# EAGLE design Tracking_V0.1 (EAGLE 7.2.0)
CNAME: EARS PocketQube HAB Tracking; CREVISION: 0.1; DESIGNER: M. Isbell
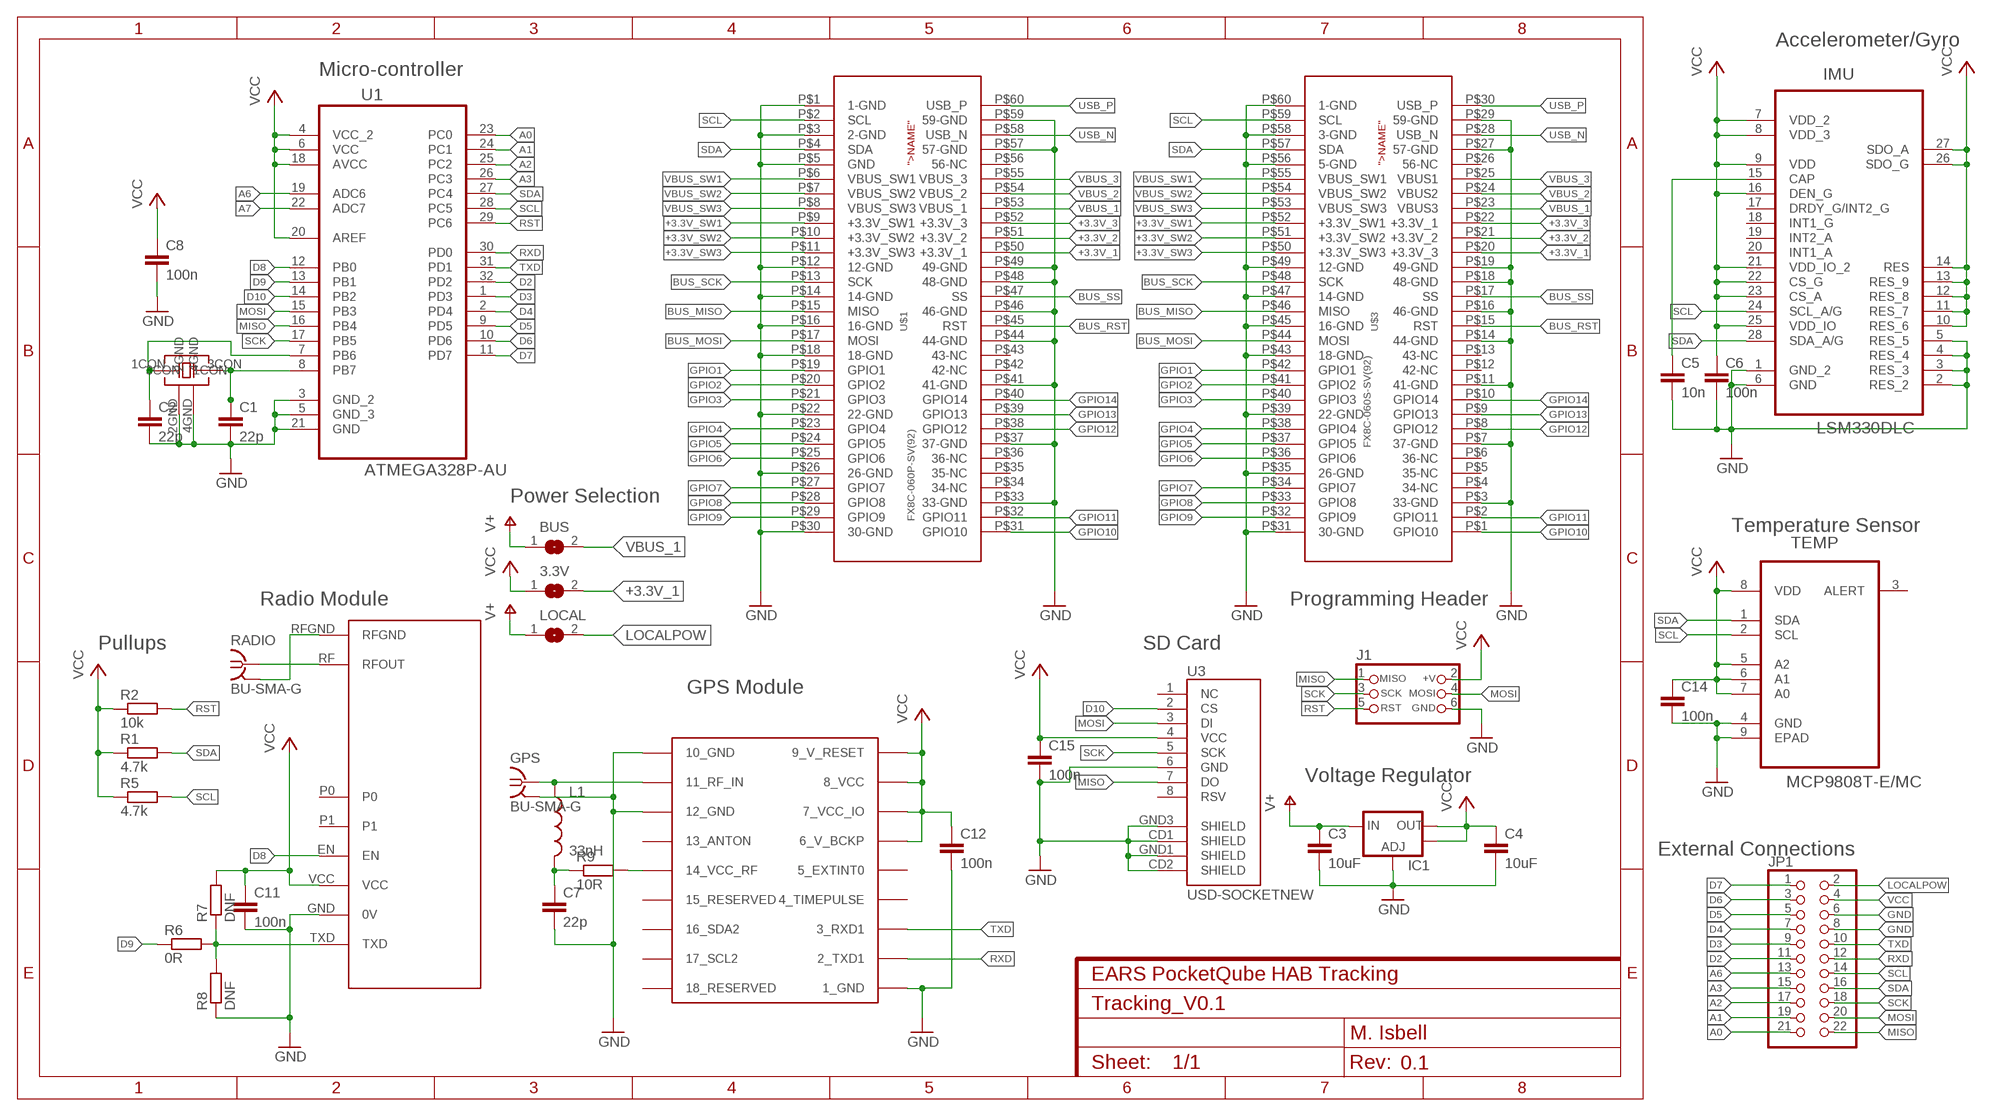
[diagram p0: schematic, sheet 1]

## Parts
3.3V  SJ  [SJ]
BUS  SJ  [SJ]
C1  22p  C-EUC0603  [C0603]
C2  22p  C-EUC0603  [C0603]
C3  10uF  C-EUC0603  [C0603]
C4  10uF  C-EUC0603  [C0603]
C5  10n  C-EUC0603  [C0603]
C6  100n  C-EUC0603  [C0603]
C7  22p  C-EUC0603  [C0603]
C8  100n  C-EUC0603  [C0603]
C11  100n  C-EUC0603  [C0603]
C12  100n  C-EUC0603  [C0603]
C14  100n  C-EUC0603  [C0603]
C15  100n  C-EUC0603  [C0603]
GPS  BU-SMA-G  [BU-SMA-G]
IC1  V_REG_LM1117SOT223  [SOT223]
IMU  LSM330DLC  [LGA28R50P6X8_400X500X110]
J1  CON_HEADER_PRG_AVR_ICSP-PTH  [HEADER_PRG_2X03]
JP1  PINHD-2X11  [2X11]
L1  33nH  INDUCTOR0603  [0603]
LOCAL  SJ  [SJ]
R1  4.7k  R-EU_R0603  [R0603]
R2  10k  R-EU_R0603  [R0603]
R5  4.7k  R-EU_R0603  [R0603]
R6  0R  R-EU_R0603  [R0603]
R7  DNF  R-EU_R0603  [R0603]
R8  DNF  R-EU_R0603  [R0603]
R9  10R  R-EU_R0603  [R0603]
RADIO  BU-SMA-G  [BU-SMA-G]
TEMP  MCP9808T-E/MC  [DFN300X200X100-9N]
U1  ATMEGA328P-AU  [QFP80P900X900X120-32N]
U3  USD-SOCKETNEW  [MICRO-SD-SOCKET-PP]
U$1  FX8C-060P-SV(92)  [FX8C-060P-SV(92)]
U$2  CRYSTAL  [CRYSTAL]
U$3  FX8C-060S-SV(92)  [FX8C-060S-SV(92)]
U$4  UBLOX_MAX  [UBLOX_MAX]
U$6  RADIOMETRIX-MTX2  [RADIOMETRIX-MTX2]

## Nets
+3.3V_1: 3.3V.2 U$1.P$50(+3.3V_1) U$3.P$20(+3.3V_3)
+3.3V_2: U$1.P$51(+3.3V_2) U$3.P$21(+3.3V_2)
+3.3V_3: U$1.P$52(+3.3V_3) U$3.P$22(+3.3V_1)
+3.3V_SW1: U$1.P$9(+3.3V_SW1) U$3.P$52(+3.3V_SW1)
+3.3V_SW2: U$1.P$10(+3.3V_SW2) U$3.P$51(+3.3V_SW2)
+3.3V_SW3: U$1.P$11(+3.3V_SW3) U$3.P$50(+3.3V_SW3)
A0: JP1.21 U1.23(PC0)
A1: JP1.19 U1.24(PC1)
A2: JP1.17 U1.25(PC2)
A3: JP1.15 U1.26(PC3)
A6: JP1.13 U1.19(ADC6)
A7: U1.22(ADC7)
BUS_MISO: U$1.P$15(MISO) U$3.P$46(MISO)
BUS_MOSI: U$1.P$17(MOSI) U$3.P$44(MOSI)
BUS_RST: U$1.P$45(RST) U$3.P$15(RST)
BUS_SCK: U$1.P$13(SCK) U$3.P$48(SCK)
BUS_SS: U$1.P$47(SS) U$3.P$17(SS)
D2: JP1.11 U1.32(PD2)
D3: JP1.9 U1.1(PD3)
D4: JP1.7 U1.2(PD4)
D5: JP1.5 U1.9(PD5)
D6: JP1.3 U1.10(PD6)
D7: JP1.1 U1.11(PD7)
D8: U1.12(PB0) U$6.EN
D9: R6.1 U1.13(PB1)
D10: U1.14(PB2) U3.2(CS)
GND: C1.2 C2.2 C3.2 C4.2 C5.2 C6.2 C7.2 C8.2 C11.2 C12.2 C14.2 C15.2 GPS.2 GPS.3 GPS.4 GPS.5 IC1.1(ADJ) IMU.1(GND_2) IMU.2(RES_2) IMU.3(RES_3) IMU.4(RES_4) IMU.5(RES_5) IMU.6(GND) J1.6(GND) JP1.6 JP1.8 R8.1 TEMP.4(GND) TEMP.9(EPAD) U1.3(GND_2) U1.5(GND_3) U1.21(GND) U3.6(GND) U3.CD1(SHIELD) U3.CD2(SHIELD) U3.GND1(SHIELD) U3.GND3(SHIELD) U$1.P$1(1-GND) U$1.P$3(2-GND) U$1.P$5(GND) U$1.P$12(12-GND) U$1.P$14(14-GND) U$1.P$16(16-GND) U$1.P$18(18-GND) U$1.P$22(22-GND) U$1.P$26(26-GND) U$1.P$30(30-GND) U$1.P$33(33-GND) U$1.P$37(37-GND) U$1.P$41(41-GND) U$1.P$44(44-GND) U$1.P$46(46-GND) U$1.P$48(48-GND) U$1.P$49(49-GND) U$1.P$57(57-GND) U$1.P$59(59-GND) U$2.2GND U$2.4GND U$3.P$3(33-GND) U$3.P$7(37-GND) U$3.P$11(41-GND) U$3.P$14(44-GND) U$3.P$16(46-GND) U$3.P$18(48-GND) U$3.P$19(49-GND) U$3.P$27(57-GND) U$3.P$29(59-GND) U$3.P$31(30-GND) U$3.P$35(26-GND) U$3.P$39(22-GND) U$3.P$43(18-GND) U$3.P$45(16-GND) U$3.P$47(14-GND) U$3.P$49(12-GND) U$3.P$56(5-GND) U$3.P$58(3-GND) U$3.P$60(1-GND) U$4.1_GND U$4.10_GND U$4.12_GND U$6.GND(0V)
GPIO1: U$1.P$19(GPIO1) U$3.P$42(GPIO1)
GPIO2: U$1.P$20(GPIO2) U$3.P$41(GPIO2)
GPIO3: U$1.P$21(GPIO3) U$3.P$40(GPIO3)
GPIO4: U$1.P$23(GPIO4) U$3.P$38(GPIO4)
GPIO5: U$1.P$24(GPIO5) U$3.P$37(GPIO5)
GPIO6: U$1.P$25(GPIO6) U$3.P$36(GPIO6)
GPIO7: U$1.P$27(GPIO7) U$3.P$34(GPIO7)
GPIO8: U$1.P$28(GPIO8) U$3.P$33(GPIO8)
GPIO9: U$1.P$29(GPIO9) U$3.P$32(GPIO9)
GPIO10: U$1.P$31(GPIO10) U$3.P$1(GPIO10)
GPIO11: U$1.P$32(GPIO11) U$3.P$2(GPIO11)
GPIO12: U$1.P$38(GPIO12) U$3.P$8(GPIO12)
GPIO13: U$1.P$39(GPIO13) U$3.P$9(GPIO13)
GPIO14: U$1.P$40(GPIO14) U$3.P$10(GPIO14)
LOCALPOW: JP1.2 LOCAL.2
MISO: J1.1(MISO) JP1.22 U1.16(PB4) U3.7(DO)
MOSI: J1.4(MOSI) JP1.20 U1.15(PB3) U3.3(DI)
N$1: GPS.1 L1.1 U$4.11_RF_IN
N$2: C1.1 U1.8(PB7) U$2.3CON
N$3: R9.2 U$4.14_VCC_RF
N$4: C2.1 U1.7(PB6) U$2.1CON
N$6: RADIO.1 U$6.RF(RFOUT)
N$7: R6.2 R7.1 R8.2 U$6.TXD
N$8: C7.1 L1.2 R9.1
N$12: C5.1 IMU.15(CAP)
RFGND: RADIO.2 RADIO.3 RADIO.4 RADIO.5 U$6.RFGND
RST: J1.5(RST) R2.2 U1.29(PC6)
RXD: JP1.12 U1.30(PD0) U$4.2_TXD1
SCK: J1.3(SCK) JP1.18 U1.17(PB5) U3.5(SCK)
SCL: IMU.24(SCL_A/G) JP1.14 R5.2 TEMP.2(SCL) U1.28(PC5) U$1.P$2(SCL) U$3.P$59(SCL)
SDA: IMU.28(SDA_A/G) JP1.16 R1.2 TEMP.1(SDA) U1.27(PC4) U$1.P$4(SDA) U$3.P$57(SDA)
TXD: JP1.10 U1.31(PD1) U$4.3_RXD1
USB_N: U$1.P$58(USB_N) U$3.P$28(USB_N)
USB_P: U$1.P$60(USB_P) U$3.P$30(USB_P)
V+: BUS.1 C3.1 IC1.3(IN) LOCAL.1
VBUS_1: BUS.2 U$1.P$53(VBUS_1) U$3.P$23(VBUS3)
VBUS_2: U$1.P$54(VBUS_2) U$3.P$24(VBUS2)
VBUS_3: U$1.P$55(VBUS_3) U$3.P$25(VBUS1)
VBUS_SW1: U$1.P$6(VBUS_SW1) U$3.P$55(VBUS_SW1)
VBUS_SW2: U$1.P$7(VBUS_SW2) U$3.P$54(VBUS_SW2)
VBUS_SW3: U$1.P$8(VBUS_SW3) U$3.P$53(VBUS_SW3)
VCC: 3.3V.1 C4.1 C6.1 C8.1 C11.1 C12.1 C14.1 C15.1 IC1.2(OUT) IC1.4(OUT) IMU.7(VDD_2) IMU.8(VDD_3) IMU.9(VDD) IMU.10(RES_6) IMU.11(RES_7) IMU.12(RES_8) IMU.13(RES_9) IMU.14(RES) IMU.16(DEN_G) IMU.21(VDD_IO_2) IMU.22(CS_G) IMU.23(CS_A) IMU.25(VDD_IO) IMU.26(SDO_G) IMU.27(SDO_A) J1.2(+V) JP1.4 R1.1 R2.1 R5.1 R7.2 TEMP.5(A2) TEMP.6(A1) TEMP.7(A0) TEMP.8(VDD) U1.4(VCC_2) U1.6(VCC) U1.18(AVCC) U1.20(AREF) U3.4(VCC) U$4.6_V_BCKP U$4.7_VCC_IO U$4.8_VCC U$4.9_V_RESET U$6.VCC
Unconnected: IMU.17(DRDY_G/INT2_G) IMU.18(INT1_G) IMU.19(INT2_A) IMU.20(INT1_A) TEMP.3(ALERT) U3.1(NC) U3.8(RSV) U$1.P$34(34-NC) U$1.P$35(35-NC) U$1.P$36(36-NC) U$1.P$42(42-NC) U$1.P$43(43-NC) U$1.P$56(56-NC) U$3.P$4(34-NC) U$3.P$5(35-NC) U$3.P$6(36-NC) U$3.P$12(42-NC) U$3.P$13(43-NC) U$3.P$26(56-NC) U$4.4_TIMEPULSE U$4.5_EXTINT0 U$4.13_ANTON U$4.15_RESERVED U$4.16_SDA2 U$4.17_SCL2 U$4.18_RESERVED U$6.P0 U$6.P1

## Notes on the sheet
- Accelerometer/Gyro
- Micro-controller
- Power Selection
- Temperature Sensor
- Radio Module | Programming Header
- Pullups | SD Card
- GPS Module
- Voltage Regulator
- External Connections

## Library data of the parts
3.3V BUS LOCAL = jumper:SJ: SMD solder JUMPER
C1 C2 C7 = rcl:C-EU: CAPACITOR, European symbol; OC_FARNELL: 2309012
C3 C4 = rcl:C-EU: CAPACITOR, European symbol; OC_FARNELL: 2426958
C5 = rcl:C-EU: CAPACITOR, European symbol; OC_FARNELL: 2066471
C6 C8 C11 C12 C14 C15 = rcl:C-EU: CAPACITOR, European symbol; OC_FARNELL: 2429362
GPS RADIO = con-coax:BU-SMA-G: FEMALE SMA CONNECTOR Radiall distributor RS 193-9117; OC_FARNELL: unknown; OC_NEWARK: unknown
IC1 = SparkFun:V_REG_LM1117: Voltage Regulator LM1117 Standard adjustable voltage regulator but in SMD form. Spark Fun Electronics SKU : COM-00595; OC_FARNELL: 1651283
IMU = mattsLib:LSM330DLC: ACC/GYRO, 3D, 16G, 2000DPS, 28LGA; MPN: LSM330DLC; OC_FARNELL: 2295820; OC_NEWARK: 68W6732; PACKAGE: LGA-28L; SUPPLIER: STMicroelectronics
J1 = dp_devices:CON_HEADER_PRG_AVR_ICSP: 2x3 AVR ICSP programming header; OC_FARNELL: 2311147
JP1 = pinhead:PINHD-2X11: PIN HEADER
L1 = SparkFun:INDUCTOR: Inductors Basic Inductor/Choke - 0603 and 1206. Footprints are not proven and vary greatly between part numbers.; OC_FARNELL: 2285904
R1 R5 R7 R8 = rcl:R-EU_: RESISTOR, European symbol; OC_FARNELL: 1799457
R2 = rcl:R-EU_: RESISTOR, European symbol; OC_FARNELL: 1652827
R6 = rcl:R-EU_: RESISTOR, European symbol; OC_FARNELL: 2309106
R9 = rcl:R-EU_: RESISTOR, European symbol; OC_FARNELL: 2321756
TEMP = mattsLib:MCP9808T-E/MC: TEMP SENSOR, I2C, -20 TO 100 DEG, 8DFN; MPN: MCP9808T-E/MC; OC_FARNELL: 2080524; OC_NEWARK: 73T0714; PACKAGE: 8DFN; SUPPLIER: Microchip
U1 = Atmel_By_element14_Batch_1-00:ATMEGA328P-AU: 8-bit Microcontroller with In-System Programmable Flash; MPN: ATMEGA328P-AU; OC_FARNELL: 1715486; OC_NEWARK: 14R4631; PACKAGE: TQFP-32; SUPPLIER: Atmel
U3 = SparkFun:USD-SOCKET: microSD Socket Push-push type uSD socket. Schematic element and footprint production proven. Spark Fun Electronics SKU : PRT-00127. tDoc lines correctly indicate media card edge positions when inserting (unlocked, locked, depressed).; OC_FARNELL: 2443092
U$1 = PQ_components:FX8C-060P-SV(92): FX8C-060P-SV(92) Hirose plug, for use in the PocketQube Standard boards. Device model created 10/2/14 By Stuart McAndrew AKA OzQube-1 Twitter - @ssshocker
U$2 = mattsLib:CRYSTAL; OC_FARNELL: 1842060
U$3 = PQ_components:FX8C-060S-SV(92): This is the bottom connector for a standard PocketQube board. Created by Stuart McAndrew AKA OzQube-1 17/2/14
U$4 = Ava:UBLOX_MAX: UBLOX MAX
U$6 = Ava:RADIOMETRIX-MTX2

## Board
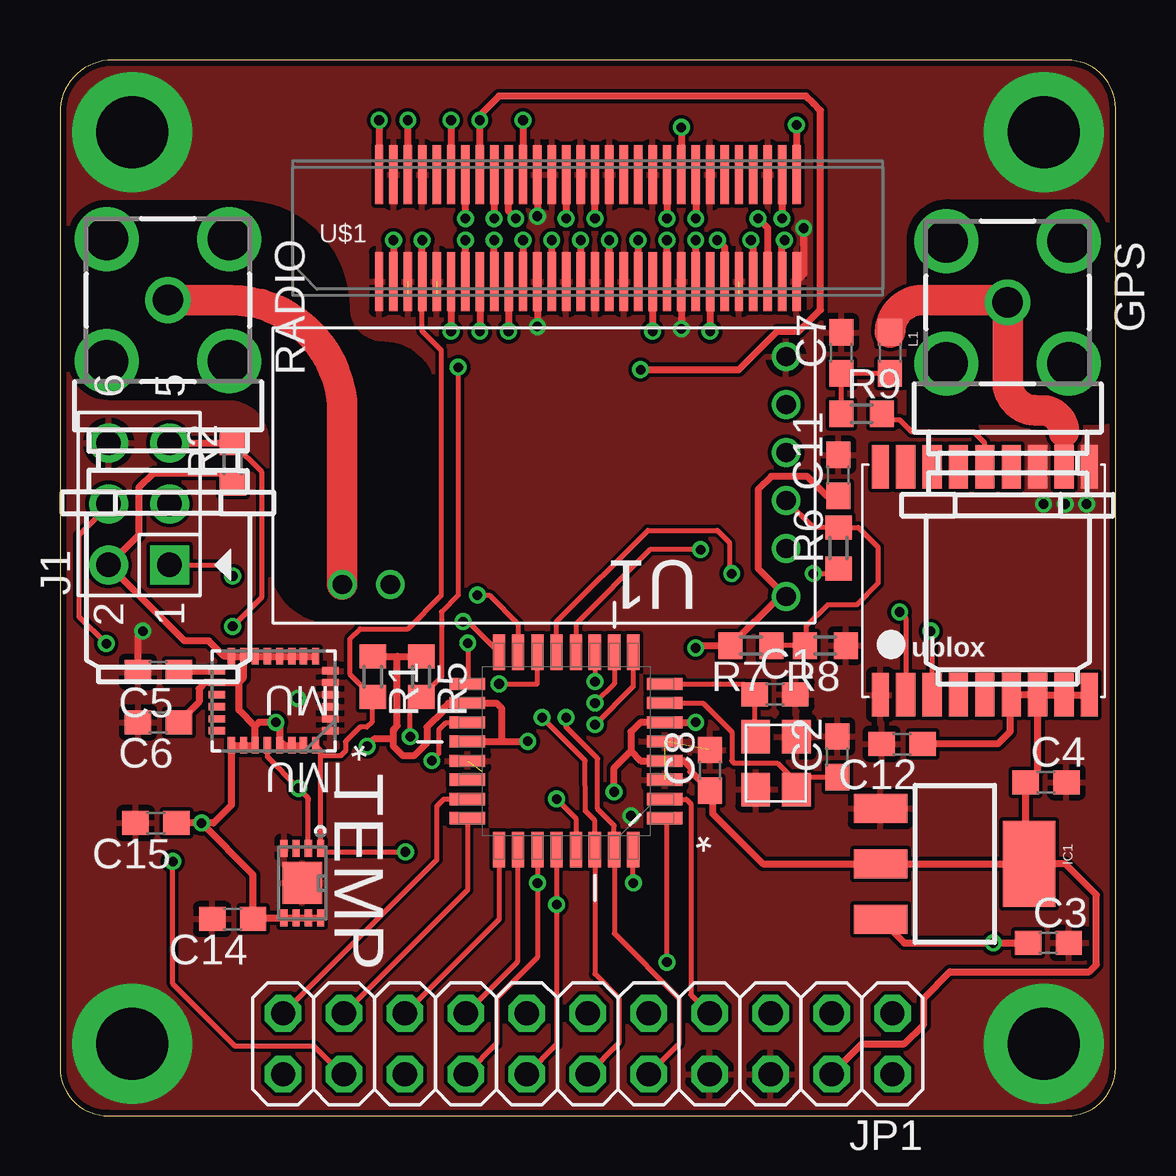
[diagram p1: board, top side]
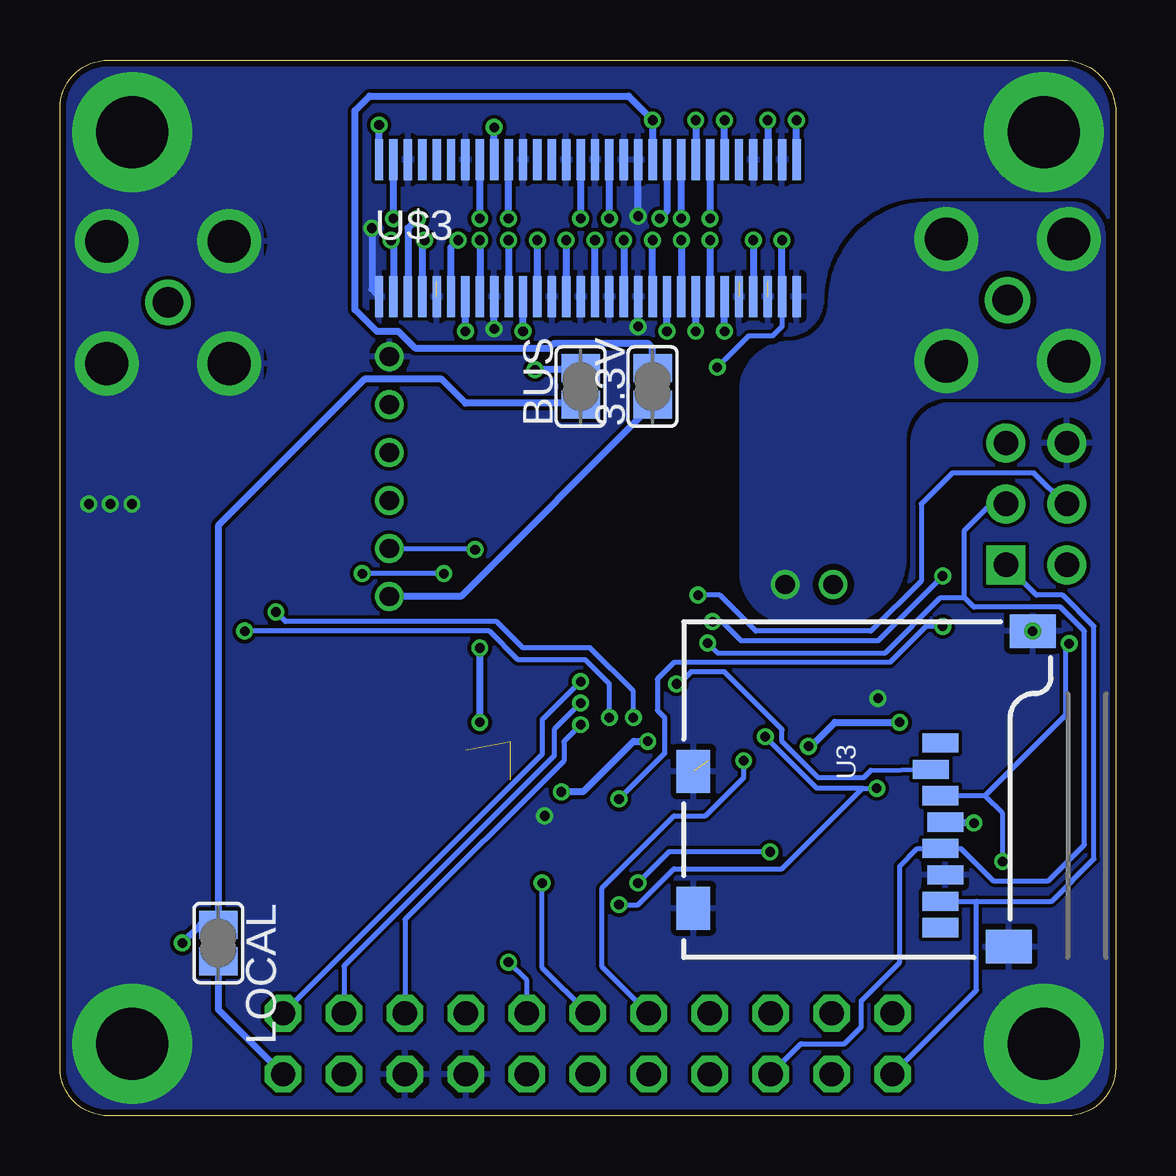
[diagram p2: board, bottom side, seen from below]

Size 44 x 44.01 mm. Coordinates in mm from the lower left corner, seen from the top.
Outline: 2,0 42,0 arc90 44,2 44,42 arc90 42,44 2.4,44 arc90 0,42 0,2 arc90 2,0
Copper layers (1*2*15*16): Top 0.035mm / dielectric 0.2mm / layer 2 0.0175mm / dielectric 1.1mm / layer 15 0.0175mm / dielectric 0.2mm / Bottom 0.035mm
Design rules "SeeedStudio_DRU_no_angle_20130527": minimum track width 6mil, minimum drill 12mil, track to track 6mil, track to pad 6mil, pad to pad 6mil, via to via 6mil, smd to smd 0mil, copper to edge 10mil, drill to drill 10mil, minimum pad ring 6mil, minimum via ring 6mil, stop-mask expansion 2mil, vias tented up to drill 25mil, thermal gap 10mil
tRestrict: area 35.5,29 to 43.5,38; 14 lines

### Footprints (pad centres in the part's own frame; a part is rotated, then mirrored left to right if it is on the bottom)
SJ = smd 1.168 x 1.6: 1 -0.762,0; 2 0.762,0
C0603 = smd 1.1 x 1: 1 -0.85,0; 2 0.85,0
BU-SMA-G = drill 1.27: 1 0,0 | drill 1.778: 2 -2.55,2.55; 3 2.55,2.55; 4 2.55,-2.55; 5 -2.55,-2.55
SOT223 = smd 1.219 x 2.235: 1 -2.311,-3.099; 2 0,-3.099; 3 2.311,-3.099 | smd 3.6 x 2.2: 4 0,3.099
LGA28R50P6X8_400X500X110 = smd 0.686 x 0.305: 1 -2.362,1.245; 2 -2.362,0.762; 3 -2.362,0.254; 4 -2.362,-0.254; 5 -2.362,-0.762; 6 -2.362,-1.245; 15 2.362,-1.245; 16 2.362,-0.762; 17 2.362,-0.254; 18 2.362,0.254; 19 2.362,0.762; 20 2.362,1.245 | smd 0.305 x 0.686: 7 -1.753,-1.854; 8 -1.245,-1.854; 9 -0.762,-1.854; 10 -0.254,-1.854; 11 0.254,-1.854; 12 0.762,-1.854; 13 1.245,-1.854; 14 1.753,-1.854; 21 1.753,1.854; 22 1.245,1.854; 23 0.762,1.854; 24 0.254,1.854; 25 -0.254,1.854; 26 -0.762,1.854; 27 -1.245,1.854; 28 -1.753,1.854
HEADER_PRG_2X03 = drill 1.02 pad 1.632 square: 1 -2.54,-1.27 | drill 1.02 pad 1.632: 2 -2.54,1.27; 3 0,-1.27; 4 0,1.27; 5 2.54,-1.27; 6 2.54,1.27
2X11 = drill 1.016 octagon: 1 -12.7,-1.27; 2 -12.7,1.27; 3 -10.16,-1.27; 4 -10.16,1.27; 5 -7.62,-1.27; 6 -7.62,1.27; 7 -5.08,-1.27; 8 -5.08,1.27; 9 -2.54,-1.27; 10 -2.54,1.27; 11 0,-1.27; 12 0,1.27; 13 2.54,-1.27; 14 2.54,1.27; 15 5.08,-1.27; 16 5.08,1.27; 17 7.62,-1.27; 18 7.62,1.27; 19 10.16,-1.27; 20 10.16,1.27; 21 12.7,-1.27; 22 12.7,1.27
0603 = smd 1.1 x 1: 1 -0.85,0; 2 0.85,0
R0603 = smd 1 x 1.1: 1 -0.85,0; 2 0.85,0
DFN300X200X100-9N = smd 0.711 x 0.305: 1 -1.448,0.762; 2 -1.448,0.254; 3 -1.448,-0.254; 4 -1.448,-0.762; 5 1.448,-0.762; 6 1.448,-0.254; 7 1.448,0.254; 8 1.448,0.762 | smd 1.753 x 1.651: 9 0,0
QFP80P900X900X120-32N = smd 1.473 x 0.508: 1 -4.115,2.794; 2 -4.115,2.007; 3 -4.115,1.194; 4 -4.115,0.406; 5 -4.115,-0.406; 6 -4.115,-1.194; 7 -4.115,-2.007; 8 -4.115,-2.794; 17 4.115,-2.794; 18 4.115,-2.007; 19 4.115,-1.194; 20 4.115,-0.406; 21 4.115,0.406; 22 4.115,1.194; 23 4.115,2.007; 24 4.115,2.794 | smd 0.508 x 1.473: 9 -2.794,-4.115; 10 -2.007,-4.115; 11 -1.194,-4.115; 12 -0.406,-4.115; 13 0.406,-4.115; 14 1.194,-4.115; 15 2.007,-4.115; 16 2.794,-4.115; 25 2.794,4.115; 26 2.007,4.115; 27 1.194,4.115; 28 0.406,4.115; 29 -0.406,4.115; 30 -1.194,4.115; 31 -2.007,4.115; 32 -2.794,4.115
MICRO-SD-SOCKET-PP = smd 0.8 x 1.5: 1 -8.94,10.7; 2 -7.84,10.3; 3 -6.74,10.7; 4 -5.64,10.9; 5 -4.54,10.7; 6 -3.44,10.9; 7 -2.34,10.7; 8 -1.24,10.7 | smd 1.8 x 1.4: CD1 -2.05,0.4; CD2 -7.75,0.4 | smd 1.4 x 1.9: GND1 -13.6,14.55; GND3 -0.45,13.55
FX8C-060P-SV(92) = smd 0.35 x 2.45: P$1 -8.7,-2.225; P$2 -8.1,-2.225; P$3 -7.5,-2.225; P$4 -6.9,-2.225; P$5 -6.3,-2.225; P$6 -5.7,-2.225; P$7 -5.1,-2.225; P$8 -4.5,-2.225; P$9 -3.9,-2.225; P$10 -3.3,-2.225; P$11 -2.7,-2.225; P$12 -2.1,-2.225; P$13 -1.5,-2.225; P$14 -0.9,-2.225; P$15 -0.3,-2.225; P$16 0.3,-2.225; P$17 0.9,-2.225; P$18 1.5,-2.225; P$19 2.1,-2.225; P$20 2.7,-2.225; P$21 3.3,-2.225; P$22 3.9,-2.225; P$23 4.5,-2.225; P$24 5.1,-2.225; P$25 5.7,-2.225; P$26 6.3,-2.225; P$27 6.9,-2.225; P$28 7.5,-2.225; P$29 8.1,-2.225; P$30 8.7,-2.225; P$31 8.7,2.225; P$32 8.1,2.225; P$33 7.5,2.225; P$34 6.9,2.225; P$35 6.3,2.225; P$36 5.7,2.225; P$37 5.1,2.225; P$38 4.5,2.225; P$39 3.9,2.225; P$40 3.3,2.225; P$41 2.7,2.225; P$42 2.1,2.225; P$43 1.5,2.225; P$44 0.9,2.225; P$45 0.3,2.225; P$46 -0.3,2.225; P$47 -0.9,2.225; P$48 -1.5,2.225; P$49 -2.1,2.225; P$50 -2.7,2.225; P$51 -3.3,2.225; P$52 -3.9,2.225; P$53 -4.5,2.225; P$54 -5.1,2.225; P$55 -5.7,2.225; P$56 -6.3,2.225; P$57 -6.9,2.225; P$58 -7.5,2.225; P$59 -8.1,2.225; P$60 -8.7,2.225
CRYSTAL = smd 1.4 x 1.2: 1CON 0.7,-2.3; 2GND 2.9,-2.3; 3CON 2.9,-0.6; 4GND 0.7,-0.6
FX8C-060S-SV(92) = smd 0.35 x 1.7: P$1 -8.7,2.85; P$2 -8.1,2.85; P$3 -7.5,2.85; P$4 -6.9,2.85; P$5 -6.3,2.85; P$6 -5.7,2.85; P$7 -5.1,2.85; P$8 -4.5,2.85; P$9 -3.9,2.85; P$10 -3.3,2.85; P$11 -2.7,2.85; P$12 -2.1,2.85; P$13 -1.5,2.85; P$14 -0.9,2.85; P$15 -0.3,2.85; P$16 0.3,2.85; P$17 0.9,2.85; P$18 1.5,2.85; P$19 2.1,2.85; P$20 2.7,2.85; P$21 3.3,2.85; P$22 3.9,2.85; P$23 4.5,2.85; P$24 5.1,2.85; P$25 5.7,2.85; P$26 6.3,2.85; P$27 6.9,2.85; P$28 7.5,2.85; P$29 8.1,2.85; P$30 8.7,2.85; P$31 -8.7,-2.85; P$32 -8.1,-2.85; P$33 -7.5,-2.85; P$34 -6.9,-2.85; P$35 -6.3,-2.85; P$36 -5.7,-2.85; P$37 -5.1,-2.85; P$38 -4.5,-2.85; P$39 -3.9,-2.85; P$40 -3.3,-2.85; P$41 -2.7,-2.85; P$42 -2.1,-2.85; P$43 -1.5,-2.85; P$44 -0.9,-2.85; P$45 -0.3,-2.85; P$46 0.3,-2.85; P$47 0.9,-2.85; P$48 1.5,-2.85; P$49 2.1,-2.85; P$50 2.7,-2.85; P$51 3.3,-2.85; P$52 3.9,-2.85; P$53 4.5,-2.85; P$54 5.1,-2.85; P$55 5.7,-2.85; P$56 6.3,-2.85; P$57 6.9,-2.85; P$58 7.5,-2.85; P$59 8.1,-2.85; P$60 8.7,-2.85
UBLOX_MAX = smd 1.8 x 0.7: 1_GND 4.95,-4.4; 9_V_RESET 4.95,4.3; 10_GND -4.55,4.3; 18_RESERVED -4.55,-4.4 | smd 1.8 x 0.8: 2_TXD1 4.95,-3.35; 3_RXD1 4.95,-2.25; 4_TIMEPULSE 4.95,-1.15; 5_EXTINT0 4.95,-0.05; 6_V_BCKP 4.95,1.05; 7_VCC_IO 4.95,2.15; 8_VCC 4.95,3.25; 11_RF_IN -4.55,3.25; 12_GND -4.55,2.15; 13_ANTON -4.55,1.05; 14_VCC_RF -4.55,-0.05; 15_RESERVED -4.55,-1.15; 16_SDA2 -4.55,-2.25; 17_SCL2 -4.55,-3.35
RADIOMETRIX-MTX2 = drill 0.8: EN 9.97,-3.25; GND 9.97,4.75; P0 9.97,2.75; P1 9.97,0.75; RF -8.53,-4.75; RFGND -6.53,-4.75; TXD 9.97,-1.25; VCC 9.97,-5.25

### Placement (x,y rotation side)
3.3V  19.3,30.4 90 bottom
BUS  22.3,30.4 90 bottom
C1  29.8,17.57 0 top
C2  32.4,14.96 90 top
C3  41.2,7.2 0 top
C4  41.1,13.9 0 top
C5  4.1,18.5 180 top
C6  4.1,16.4 180 top
C7  32.57,31.8 90 top
C8  27.1,14.4 90 top
C11  32.44,26.7 90 top
C12  35.1,15.5 180 top
C14  7.2,8.2 180 top
C15  4,12.2 180 top
GPS  39.5,33.9 270 top
IC1  37.3,10.5 270 top
IMU  8.9,17.3 180 top
J1  3.3,25.5 90 top
JP1  22,3 180 top
L1  34.6,31.8 270 top
LOCAL  37.4,7.2 270 bottom
R1  13.04,18.3 270 top
R2  7.2,27.2 90 top
R5  15.06,18.3 270 top
R6  32.45,23.67 90 top
R7  28.8,19.6 180 top
R8  31.9,19.6 180 top
R9  33.42,29.26 0 top
RADIO  4.5,34 270 top
TEMP  10.1,9.7 270 top
U1  21.1,15.2 180 top
U3  18,6.6 270 bottom
U$1  22,37 0 top
U$2  28.4,12.9 90 top
U$3  22,37 0 bottom
U$4  38.6,22.5 270 top
U$6  20.3,26.9 0 top

### Tracks (layer width: path | path; a pad name or v marks a point on that pad's centre or on a via)
+3.3V_1  (via drill 0.4)
  Top 0.3: v19.3,41.5 U$1.P$50
  Bottom 0.3: 3.3V.2 19.3,32 19.5,32.2 23.4,32.2 23.6,32 29.2,32 29.9,32.7 30.8,32.7 31.7,33.6 31.7,41.9 31.1,42.5 20.3,42.5 v19.3,41.5 U$3.P$20
+3.3V_2  (via drill 0.4)
  Top 0.3: v19,37.4 18.7,37.7 U$1.P$51
  Bottom 0.3: U$3.P$21 18.7,37.7 v19,37.4
+3.3V_3  (via drill 0.4)
  Top 0.3: U$1.P$52 v18.1,37.4
  Bottom 0.3: v18.1,37.4 U$3.P$22
+3.3V_SW1  (via drill 0.4)
  Top 0.3: U$1.P$9 v18.1,36.5
  Bottom 0.3: v18.1,36.5 U$3.P$52
+3.3V_SW2  (via drill 0.4)
  Top 0.3: U$1.P$10 v18.7,32.7
  Bottom 0.3: v18.7,32.7 U$3.P$51
+3.3V_SW3  (via drill 0.4)
  Top 0.3: v19.3,36.5 U$1.P$11
  Bottom 0.3: U$3.P$50 v19.3,36.5
A0
  Top 0.2: U1.23 15.99,13.19 15.7,12.9 15.7,10.67 JP1.21
A1
  Top 0.2: U1.24 16.98,9.41 JP1.19
A2
  Top 0.2: U1.25 18.31,8.2 JP1.17
A3
  Top 0.2: JP1.15 19.09,6.44 U1.26
A6  (via drill 0.4)
  Top 0.2: v15.5,14.8 15.8,15.1 15.8,16.1 16.09,16.39 U1.19
  Bottom 0.2: JP1.13 21.4,6.21 21.4,9.5 18.4,12.5 17.1,12.5 15.5,14.1 v15.5,14.8
BUS_MISO  (via drill 0.4)
  Top 0.3: v21.7,36.5 U$1.P$15
  Bottom 0.3: U$3.P$46 v21.7,36.5
BUS_MOSI  (via drill 0.4)
  Top 0.3: U$1.P$17 v22.9,36.5
  Bottom 0.3: v22.9,36.5 U$3.P$44
BUS_RST  (via drill 0.4)
  Top 0.3: v22.3,37.4 U$1.P$45
  Bottom 0.3: U$3.P$15 v22.3,37.4
BUS_SCK  (via drill 0.4)
  Top 0.3: U$1.P$13 v20.5,36.5
  Bottom 0.3: v20.5,36.5 U$3.P$48
BUS_SS  (via drill 0.4)
  Top 0.3: U$1.P$47 v21.1,37.4
  Bottom 0.3: v21.1,37.4 U$3.P$17
D2  (via drill 0.4)
  Top 0.2: v23.9,9.7 v23.89,9.71 U1.32
  Bottom 0.2: JP1.11 23.9,6.17 v23.9,9.7
D3  (via drill 0.4)
  Top 0.2: v25.3,6.4 25.3,12.32 U1.1
  Bottom 0.2: JP1.9 24.54,5.64 v25.3,6.4
D4
  Top 0.2: U1.2 26.11,13.19 26.3,13 26.3,5.05 JP1.7
D5  (via drill 0.4)
  Top 0.2: U1.9 23.89,17.89 v22.3,16.3
  Bottom 0.2: v22.3,16.3 23,15.6 23,14.8 29.62,8.18 JP1.5
D6  (via drill 0.4)
  Top 0.2: U1.10 23.11,18.01 v22.3,17.2
  Bottom 0.2: v22.3,17.2 23.4,16.1 23.4,15 32.16,6.24 JP1.3
D7  (via drill 0.4)
  Top 0.2: U1.11 v22.29,18.11 v22.3,18.1
  Bottom 0.2: v22.3,18.1 23.9,16.5 23.9,15.07 JP1.1
D8  (via drill 0.4)
  Top 0.2: v26.7,23.6 24.6,23.6 21.51,20.51 U1.12
  Bottom 0.2: U$6.EN 26.75,23.65 v26.7,23.6
D9  (via drill 0.4)
  Top 0.2: 32.33,22.7 R6.1 32.23,22.6 v31.4,22.6 | U1.13 20.69,20.59 24.5,24.4 27.4,24.4 27.9,23.9 27.9,22.7 v28,22.6
  Bottom 0.2: v28,22.6 v31.4,22.6
D10  (via drill 0.4)
  Top 0.2: v18.3,18 19.91,18.01 U1.14
  Bottom 0.2: v18.3,18 18.2,18 17.7,18.5 16.3,18.5 13.9,16.1 13.9,15.6 12.4,14.1 10.5,14.1 10.2,14.4 U3.2
GND  (via drill 0.4, 3 pad 5)  (6 unrouted)
  Top 0.3: U$1.P$49 v19.9,37.5 | U$1.P$22 v25.9,32.8 | U$1.P$30 31,35.08 v31,37 | U$1.P$12 v19.9,32.9 | C5.2 3.25,20 U3.GND1
  Bottom 0.3: v19.9,37.5 U$3.P$19 | v25.9,32.8 U$3.P$39 | v31,37 31,34.45 U$3.P$31 | v19.9,32.9 U$3.P$49 | U3.GND1 2.8,20.2
  other vias: 3,41 41,41 41,3 3,3 41,25.5 41.9,25.5 42.8,25.5 9.9,17.4 3.45,20.2 23.8,12.5
  pour Bottom (no thermals): 37,38 42.5,38 arc-90 43.9,36.6 43.9,25.9 arc-90 43,25 41,25 arc-90 40,26 40,26.5 arc90 38,28.5 arc-90 35.6,30.9 35.6,31.4 35.6,36.7 arc-90 36.9,38
  pour Top (no thermals): 39.9,26.7 39.9,26.2 arc90 41.1,25 43,25 arc90 44,26 44,28 arc90 43,29 40.9,29 arc90 40,28.1 40,26.8 arc-90
  pour Top (rank 2): 0,0 44,0 44,44 0,44
  pour Bottom (rank 2): 0,0 44,0 44,44 0,44
GPIO1  (via drill 0.4)
  Top 0.3: v24.1,36.5 U$1.P$19
  Bottom 0.3: U$3.P$42 v24.1,36.5
GPIO2  (via drill 0.4)
  Top 0.3: U$1.P$20 v24.7,32.7
  Bottom 0.3: v24.7,32.7 U$3.P$41
GPIO3  (via drill 0.4)
  Top 0.3: U$1.P$21 v25.3,36.5
  Bottom 0.3: v25.3,36.5 U$3.P$40
GPIO4  (via drill 0.4)
  Top 0.3: U$1.P$23 v26.5,36.5
  Bottom 0.3: v26.5,36.5 U$3.P$38
GPIO5  (via drill 0.4)
  Top 0.3: U$1.P$24 v27.1,32.7
  Bottom 0.3: v27.1,32.7 U$3.P$37
GPIO6  (via drill 0.4)
  Top 0.3: v27.4,36.5 27.7,36.2 U$1.P$25
  Bottom 0.3: U$3.P$36 27.7,36.2 v27.4,36.5
GPIO7  (via drill 0.4)
  Top 0.3: U$1.P$27 28.9,36.4 v28.8,36.5
  Bottom 0.3: v28.8,36.5 28.9,36.4 U$3.P$34
GPIO8  (via drill 0.4)
  Top 0.3: U$1.P$28 29.5,37 v29.1,37.4
  Bottom 0.3: v29.1,37.4 29.5,37 U$3.P$33
GPIO9  (via drill 0.4)
  Top 0.3: U$1.P$29 30.1,36.4 v30.2,36.5
  Bottom 0.3: v30.2,36.5 30.1,36.4 U$3.P$32
GPIO10  (via drill 0.4)
  Top 0.3: v30.7,41.3 U$1.P$31
  Bottom 0.3: U$3.P$1 v30.7,41.3
GPIO11  (via drill 0.4)
  Top 0.3: U$1.P$32 v30.1,37.4
  Bottom 0.3: v30.1,37.4 U$3.P$2
GPIO12  (via drill 0.4)
  Top 0.3: U$1.P$38 v26.5,37.4
  Bottom 0.3: v26.5,37.4 U$3.P$8
GPIO13  (via drill 0.4)
  Top 0.3: v25.9,41.2 U$1.P$39
  Bottom 0.3: U$3.P$9 v25.9,41.2
GPIO14  (via drill 0.4)
  Top 0.3: U$1.P$40 v25.3,37.4
  Bottom 0.3: v25.3,37.4 U$3.P$10
LOCALPOW
  Bottom 0.3: LOCAL.2 37.4,4.43 JP1.2
MISO  (via drill 0.4)
  Top 0.2: J1.1 6.74,22.96 v7.2,22.5 | v16.8,20.6 17.02,20.6 U1.16
  Bottom 0.2: JP1.22 5.8,5.23 5.8,8.94 | U3.7 5.8,8.94 | 5.8,8.94 2.66,8.94 0.9,10.7 0.9,20.4 2.2,21.7 3.3,21.7 J1.1 | v7.2,22.5 9.9,19.8 15.6,19.8 16.4,20.6 v16.8,20.6
MOSI  (via drill 0.4)
  Top 0.2: JP1.20 11.77,1.73 10.6,2.9 7.3,2.9 4.7,5.5 v4.7,10.6 | v1.93,19.68 0.8,20.8 0.8,24.2 2.03,25.43 J1.4 | v17.4,21.7 17.9,21.7 19.09,20.51 U1.15
  Bottom 0.2: v4.7,10.6 4.7,12.6 5.44,13.34 | 5.44,13.34 U3.3 | 5.44,13.34 2.1,16.68 2.1,19.51 v1.93,19.68 | v17.4,21.7 16.5,21.7 15,20.2 10.2,20.2 8.1,22.3 8.1,25.5 6.8,26.8 3.4,26.8 2.1,25.5 J1.4
N$1
  Top 0.8: 41.85,28.49 U$4.11_RF_IN
  Top 1.27: 41.85,28.49 arc90 40.94,29.4 40.7,29.4 arc-90 39.5,30.6 GPS.1 39.5,34 35.95,34 arc90 L1.1
N$2
  Top 0.2: U$2.3CON 28.95,15.85 C1.1 28.53,17.99 U1.8
N$3
  Top 0.2: U$4.14_VCC_RF 38.55,28.05 38.1,28.5 35.5,28.5 35,29 34.53,29 R9.2
N$4
  Top 0.2: C2.1 31.21,14.11 U$2.1CON 30.5,13.8 30.5,14.1 29.9,14.7 28.1,14.7 28,14.8 28,16 26.79,17.21 U1.7
N$6
  Top 1.27: U$6.RF 11.77,29.33 arc90 7.1,34 RADIO.1
N$7
  Top 0.2: R7.1 R8.2 31.1,19.65 31.1,20.4 32,21.3 33.2,21.3 34.1,22.2 34.1,23.7 33.28,24.52 R6.2 31.4,24.52 U$6.TXD
N$8
  Top 0.2: R9.1 C7.1 L1.2
N$12
  Top 0.3: C5.1 5.2,18.55 IMU.15
RFGND
  pour Bottom (isolate 0.254, no thermals): 1.9,38 7.8,38 arc-90 11.9,33.9 arc90 13.6,32.2 arc-90 15.6,30.2 15.6,22.7 arc-90 13.5,20.6 11.5,20.6 arc-90 8.8,23.3 8.8,27 8.8,28.2 arc90 7,30 2,30 arc-90 0.5,31.5 0.5,36.7 arc-90 1.8,38
RST  (via drill 0.4)
  Top 0.2: R2.2 8.4,26.85 8.4,21.6 v7.2,20.4 | v20.7,13.2 21.51,12.39 U1.29
  Top 0.3: J1.5 R2.2
  Bottom 0.2: v20.7,13.2 18.8,15.1 18.8,16.6 19.1,16.9 19.1,18.2 18.4,18.9 9.4,18.9 7.9,20.4 v7.2,20.4
RXD  (via drill 0.4)
  Top 0.2: JP1.12 23.3,3.03 23.3,4.9 22.29,5.91 U1.30 22.29,12.31 21.9,12.7 21.89,14.81 v20.1,16.6 | v35,21 35.25,20.75 U$4.2_TXD1
  Bottom 0.2: v20.1,16.6 20.1,17.7 21.9,19.5 24.7,19.5 25.8,20.6 34.6,20.6 v35,21
SCK  (via drill 0.4)
  Top 0.2: v17,19.7 17,18.01 U1.17
  Bottom 0.2: JP1.18 13.11,3 11.3,3 10.6,3.7 10.6,4.8 9,6.4 9,10.4 8.26,11.14 U3.5 6.44,11.14 5.1,9.8 2.8,9.8 1.3,11.3 1.3,20.2 2.3,21.2 5.9,21.2 6.3,21.6 | 6.3,21.6 6.3,24.4 5.2,25.5 J1.3 | v17,19.7 16.6,19.3 9.6,19.3 7.3,21.6 6.3,21.6
  Bottom 0.3: J1.3 4.7,25.5
SCL  (via drill 0.4)
  Top 0.2: U1.28 v20.7,8.8 20.7,2.97 JP1.14 | TEMP.2 10.35,13.15 10.35,13.24 v9.95,13.65 8.65,14.95 IMU.24 | v14.6,15.8 14.6,17.4 15.1,17.41 R5.2 15.9,18.29 15.9,21 16.6,21.7 v16.6,31.2
  Top 0.3: v13.9,36.5 U$1.P$2
  Bottom 0.2: v20.7,8.8 19.9,8.8 18.4,10.3 13.9,10.3 10.55,13.65 | 10.55,13.65 v9.95,13.65 | 10.55,13.65 12.45,13.65 v14.6,15.8 | U$3.P$59 13.9,32.9 14.3,32.5 15.3,32.5 v16.6,31.2
  Bottom 0.3: U$3.P$59 v13.9,36.5
SDA  (via drill 0.4)
  Top 0.2: U1.27 v19.91,9.7 19.91,6.61 18.2,4.9 18.2,3.01 JP1.16 | v14.4,11 11.01,11 TEMP.1 10.86,15 | 10.86,15 10.86,15.24 IMU.28 | 10.86,15 11.7,15 11.9,15.2 11.9,15.6 12.5,16.2 12.8,16.2 13,16.4 13,17.1 13.04,17.18 R1.2 12.1,18.39 12.1,19.9 12.5,20.3 14.5,20.3 15.9,21.7 15.9,31.9 15.1,32.7 U$1.P$4
  Top 0.3: U$1.P$4 v15.1,36.5
  Bottom 0.2: v14.4,11 18.61,11 v19.91,9.7
  Bottom 0.3: v15.1,36.5 U$3.P$57
TXD  (via drill 0.4)
  Top 0.2: JP1.10 25.8,2.99 25.8,4.9 23.11,7.59 U1.31 23.1,12.1 22.41,12.79 22.41,14.89 21.1,16.2 v21.1,16.6 | v36.3,20.2 36.35,20.15 U$4.3_RXD1
  Bottom 0.2: v21.1,16.6 21.1,18 22.1,19 24.9,19 26.1,20.2 v36.3,20.2
USB_N  (via drill 0.4)
  Top 0.3: U$1.P$58 v14.5,41.5
  Bottom 0.3: v14.5,41.5 U$3.P$28
USB_P  (via drill 0.4)
  Top 0.3: v13.3,41.5 U$1.P$60
  Bottom 0.3: U$3.P$30 v13.3,41.5
V+  (via drill 0.4)
  Top 0.3: IC1.3 35.19,7.2 v38.9,7.2 C3.1
  Bottom 0.3: v38.9,7.2 38.14,7.96 LOCAL.1 37.4,24.6 31.3,30.7 28.1,30.7 27.1,29.7 22.36,29.7 BUS.1
VBUS_1  (via drill 0.4)
  Top 0.3: U$1.P$53 v17.5,41.5 17.5,41.7 18,42.2 18.3,42.5 31.1,42.5 31.4,42.2 31.7,41.9 31.7,33.6 30.8,32.7 29.9,32.7 28.3,31.1 v24.2,31.1
  Bottom 0.3: BUS.2 22.36,31.1 v24.2,31.1 | v17.5,41.5 U$3.P$23
VBUS_2  (via drill 0.4)
  Top 0.3: v16.9,37.4 U$1.P$54
  Bottom 0.3: U$3.P$24 v16.9,37.4
VBUS_3  (via drill 0.4)
  Top 0.3: v16.3,41.5 U$1.P$55
  Bottom 0.3: U$3.P$25 v16.3,41.5
VBUS_SW1  (via drill 0.4)
  Top 0.3: U$1.P$6 v16.3,32.7
  Bottom 0.3: v16.3,32.7 U$3.P$55
VBUS_SW2  (via drill 0.4)
  Top 0.3: U$1.P$7 v16.9,36.5
  Bottom 0.3: v16.9,36.5 U$3.P$54
VBUS_SW3  (via drill 0.4)
  Top 0.3: U$1.P$8 v17.5,32.7
  Bottom 0.3: v17.5,32.7 U$3.P$53
VCC  (via drill 0.4)
  Top 0.3: C11.1 31.95,25.85 31.15,26.65 29.65,26.65 29.1,26.1 29.1,22.82 U$6.VCC 30,21.65 R7.2 26.6,19.6 v26.5,19.5 | U1.6 | U1.6 24.19,16.39 23.8,16 23.8,15.2 | 23.8,15.2 24.2,14.8 U1.4 | U1.4 | U1.4 26,14.8 26.3,14.5 26.3,14.35 C8.1 27.2,13.45 27.2,12.6 29.3,10.5 IC1.2 IC1.4 | IC1.4 40.25,10.65 C4.1 40.75,14.4 U$4.7_VCC_IO | U$4.7_VCC_IO U$4.6_V_BCKP 39.6,17.5 39.6,16 39.1,15.5 C12.1 | U$4.7_VCC_IO U$4.8_VCC U$4.9_V_RESET | R2.1 6.75,26.8 3.9,26.8 3.3,26.2 3.3,24.23 J1.2 5.19,19.8 6.2,19.8 6.85,19.15 IMU.14 IMU.13 | IMU.13 IMU.12 IMU.11 IMU.10 IMU.9 IMU.8 IMU.7 | 14.06,19.15 R1.1 | 14.06,19.15 R5.1 | 7.46,18.06 IMU.16 6.06,18.06 5.8,17.8 5.8,17.25 C6.1 | 9.3,15.5 IMU.25 | IMU.25 IMU.26 IMU.27 | TEMP.8 TEMP.7 TEMP.6 TEMP.5 8.1,8.25 C14.1 8.05,10.05 v5.9,12.2 | v5.9,12.2 C15.1 | U1.20 v19.5,15.61 18.4,15.6 18.4,17 18.19,17.21 U1.18 16.19,17.21 16.19,17.19 16,17 16,16.9 15.3,16.2 15.3,15.55 14.75,15 14.3,15 13.9,15.4 13.9,15.7 | v5.9,12.2 6.4,12.2 7.15,12.95 IMU.21 IMU.22 IMU.23 8.14,16.24 | JP1.4 33.43,3 35.2,3 36,3.8 36,4.9 37.1,6 42.9,6 43.2,6.3 43.2,9.2 41.9,10.5 IC1.4 | 8.14,16.24 8.3,16.4 v9,16.4 9.15,16.25 IMU.25 | 7.46,18.06 7.66,18.25 IMU.13 | 8.14,16.24 7.46,16.91 7.46,18.06 | U1.6 v26.49,16.39 v26.5,16.4 | 13.9,15.7 13.9,16.1 14.06,16.26 14.06,19.15 | 13.9,15.7 13.1,15.7 v12.8,15.4 | v23.1,13.5 23.1,14.5 23.8,15.2
  Bottom 0.3: 3.3V.1 27.29,21.65 U$6.VCC | v5.9,12.2 7.06,12.2 U3.4 | v26.5,16.4 v26.5,19.5 | v19.5,15.61 20.09,15.61 22.2,13.5 v23.1,13.5 | v12.8,15.4 12.7,15.4 11.7,16.4 v9,16.4